# Altium schematic sheet food_box_board.SchDoc: I/O Drivers
size Letter
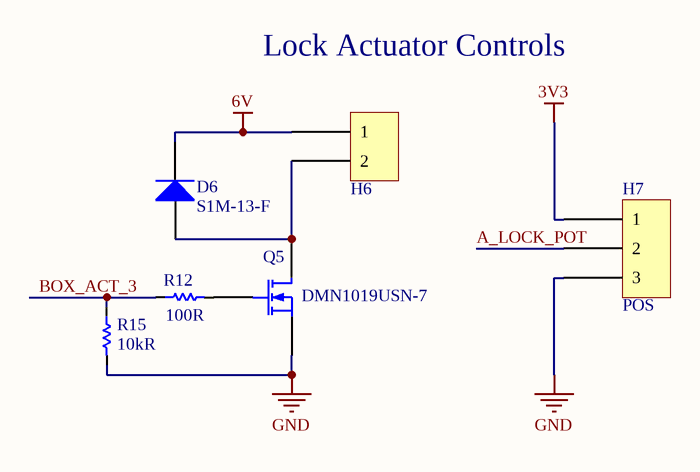
[diagram p0: food_box_board.SchDoc]

## Parts
D6  S1M-13-F  [SMA]
H6  MOLEX_43650_2  [MOLEX_43650_2]  (value not drawn)
H7  POS  [MOLEX_43650_3]
Q5  Manufacturer Part Number: DMN1019USN-7  [SOT23-3]  (hidden comment: MOSFET-N)
R12  Resistance: 100R  [RES 0603 L]  (hidden comment: value)
R15  Resistance: 10kR  [RES 0603 L]  (hidden comment: value)

## Nets
3V3: H7.1
6V: D6.2(K) H6.1
GND: H7.3 Q5.3(S) R15.1
A_LOCK_POT: H7.2
BOX_ACT_3: R12.2 R15.2
NetD6_1: D6.1(A) H6.2 Q5.1(D)
NetQ5_2: Q5.2(G) R12.1

## Notes on the sheet
- (near H6) Lock Actuator Controls
- Title
- Size:
- Date:
- Letter
- Number:
- Time:
- Revision:
- Sheet
- of
- File:

## Library data of the parts
D6 = Diode: Default Diode
H6 = MOLEX_43650_2: MOLEX - 43650-0227 - Wire-To-Board Connector, 3 mm, 2 Contacts, Header, Micro-Fit 3.0 43650 Series, Through Hole, 1 Rows; Connector Type: Header,Male Pin; Number of Positions: 2; Number of Ports: 1; Pitch: 3mm; Supplier 1: Digi-Key; Supplier Part Number 1: WM10656-ND; Manufacturer: Molex; Manufacturer Part Number: 43650-0227; Category: Connectors; Pricing 1: 1=0.80000, 10=0.74800, 100=0.57340, 500=0.49860, 1000=0.41135, 5000=0.36149, 10000=0.33656 (USD); Mount: Through Hole; Contact Plating: Tin,Bright; Color: Black; Contact Material: Brass; Housing Material: Thermoplastic; Number of Terminals: 2; Contact Shape: Square; Insulation Material: Polymer; Min Operating Temperature: -40°C; Max Operating Temperature: 105°C; Packaging: Tray; Package Quantity: 3264; Number of Rows: 1; Termination: Solder; Fastening Type: Ramp; Number of Contacts: 2; Orientation: Straight; Length: 9.65mm; Depth: 5.57mm; ComponentLink1URL: https://datasheet.ciiva.com/6840/436500227-sd-6840390.pdf?src-supplier=Digi-Key; ComponentLink1Description: https://datasheet.ciiva.com/6840/436500227-sd-6840390.pdf?src-supplier=Digi-Key; ComponentLink2URL: https://datasheet.ciiva.com/3944/28290436500227-pcb-headers-3944690.pdf?src-supplier=Arrow; ComponentLink2Description: https://datasheet.ciiva.com/3944/28290436500227-pcb-headers-3944690.pdf?src-supplier=Arrow; ComponentLink3URL: https://datasheet.ciiva.com/30077/0436500227-pcb-headers-30077244.pdf?src-supplier=Onlinecomponents.com; ComponentLink3Description: https://datasheet.ciiva.com/30077/0436500227-pcb-headers-30077244.pdf?src-supplier=Onlinecomponents.com; ComponentLink4URL: https://datasheet.ciiva.com/7920/1629867-7920765.pdf?src-supplier=Element14; ComponentLink4Description: https://datasheet.ciiva.com/7920/1629867-7920765.pdf?src-supplier=Element14
H7 = TERM_3P: Stepper position potentiometer
Q5 = MOSFET-N: MOSFET 12V N-Ch Enh FET 2426pF 27.3nC; Manufacturer: Diodes; Continuous Drain Current (ID): 9.3A; Rds On Max: 10mR; Input Capacitance: 2.426nF; Max Power Dissipation: 680mW; Capacitance: 2.426E-09F; Element Configuration: Single; Number of Channels: 1; Drain to Source Resistance: 41mR; Gate to Source Voltage (Vgs): 4.5V; Fall Time: 16.8ns; Rise Time: 57.6ns; Turn-Off Delay Time: 22.2ns; Turn-On Delay Time: 7.6ns; Supplier 1: Digi-Key; Supplier Part Number 1: DMN1019USN-7DICT-ND; Category: MOSFETs; Pricing 1: 1=0.43000, 10=0.34700, 25=0.31800, 100=0.19960, 250=0.19740, 500=0.18482, 1000=0.12568 (USD); Mount: Surface Mount; Case/Package: TO-236-3; Weight: 0.000282oz; Min Operating Temperature: -55°C; Max Operating Temperature: 150°C; Packaging: Tape and Reel; Drain to Source Voltage (Vdss): 12V; Drain to Source Breakdown Voltage: 12V; Package Quantity: 3000; Lead Free: Lead Free; ComponentLink1URL: http://www.farnell.com/datasheets/2814395.pdf?src-supplier=Farnell; ComponentLink1Description: http://www.farnell.com/datasheets/2814395.pdf?src-supplier=Farnell; ComponentLink2URL: http://www.mouser.com/ds/2/115/DMN1019USN-336718.pdf?src-supplier=Mouser; ComponentLink2Description: http://www.mouser.com/ds/2/115/DMN1019USN-336718.pdf?src-supplier=Mouser; ComponentLink3URL: https://www.diodes.com/assets/Datasheets/DMN1019USN.pdf?src-supplier=Digi-Key; ComponentLink3Description: https://www.diodes.com/assets/Datasheets/DMN1019USN.pdf?src-supplier=Digi-Key; ComponentLink4URL: http://www.farnell.com/datasheets/2814395.pdf?src-supplier=Newark; ComponentLink4Description: http://www.farnell.com/datasheets/2814395.pdf?src-supplier=Newark
R12 = RES 0603: CRGCQ 0603 100R 5%; Manufacturer: TE Connectivity; Manufacturer Part Number: CRGCQ0603J100R; Max Power Dissipation: 100mW; Temperature Coefficient: 100ppm/°C; Supplier 1: Digi-Key; Supplier Part Number 1: A130085CT-ND; Category: Chip SMD Resistors; Pricing 1: 1=0.10000, 10=0.02100, 100=0.00860, 1000=0.00387, 2500=0.00336 (USD); Case/Package: 0603; Case Code (Imperial): 0603; Case Code (Metric): 1608; Min Operating Temperature: -55°C; Max Operating Temperature: 155°C; Composition: Thick Film; Features: Moisture Resistant,Automotive AEC-Q200; Packaging: Cut Tape; Tolerance: 5%; Number of Terminations: 2; ComponentLink1URL: https://www.te.com/commerce/DocumentDelivery/DDEController?Action=srchrtrv&amp;DocNm=1773204-3&amp;DocType=DS&amp;DocLang=English&src-supplier=Digi-Key; ComponentLink1Description: https://www.te.com/commerce/DocumentDelivery/DDEController?Action=srchrtrv&amp;DocNm=1773204-3&amp;DocType=DS&amp;DocLang=English&src-supplier=Digi-Key
R15 = RES 0603: TE CONNECTIVITY - CRGCQ0603J10K - RES, 10K, 5%, 0603, THICK FILM; Max Power Dissipation: 100mW; Temperature Coefficient: 100ppm/°C; Supplier 1: Digi-Key; Supplier Part Number 1: A130097CT-ND; Manufacturer: TE Connectivity; Manufacturer Part Number: CRGCQ0603J10K; Category: Chip SMD Resistors; Pricing 1: 1=0.10000, 10=0.02100, 100=0.00860, 1000=0.00387, 2500=0.00336 (USD); Case/Package: 0603; Case Code (Imperial): 0603; Case Code (Metric): 1608; Min Operating Temperature: -55°C; Max Operating Temperature: 155°C; Composition: Thick Film; Features: Moisture Resistant,Automotive AEC-Q200; Packaging: Tape and Reel; Tolerance: 5%; Number of Terminations: 2; ComponentLink1URL: https://4donline.ihs.com/images/VipMasterIC/IC/TYEL/TYEL-S-A0004929575/TYEL-S-A0004929575-1.pdf?hkey=52A5661711E402568146F3353EA87419&src-supplier=Farnell; ComponentLink1Description: https://4donline.ihs.com/images/VipMasterIC/IC/TYEL/TYEL-S-A0004929575/TYEL-S-A0004929575-1.pdf?hkey=52A5661711E402568146F3353EA87419&src-supplier=Farnell; ComponentLink2URL: https://4donline.ihs.com/images/VipMasterIC/IC/TYEL/TYEL-S-A0004929575/TYEL-S-A0004929575-1.pdf?hkey=52A5661711E402568146F3353EA87419&src-supplier=Newark; ComponentLink2Description: https://4donline.ihs.com/images/VipMasterIC/IC/TYEL/TYEL-S-A0004929575/TYEL-S-A0004929575-1.pdf?hkey=52A5661711E402568146F3353EA87419&src-supplier=Newark; ComponentLink3URL: https://www.te.com/commerce/DocumentDelivery/DDEController?Action=srchrtrv&amp;DocNm=1773204-3&amp;DocType=DS&amp;DocLang=English&src-supplier=Digi-Key; ComponentLink3Description: https://www.te.com/commerce/DocumentDelivery/DDEController?Action=srchrtrv&amp;DocNm=1773204-3&amp;DocType=DS&amp;DocLang=English&src-supplier=Digi-Key; ComponentLink4URL: http://www.te.com/commerce/DocumentDelivery/DDEController?Action=srchrtrv&DocNm=1773204-3&DocType=DS&DocLang=English&src-supplier=Digi-Key; ComponentLink4Description: http://www.te.com/commerce/DocumentDelivery/DDEController?Action=srchrtrv&DocNm=1773204-3&DocType=DS&DocLang=English&src-supplier=Digi-Key